# Altium schematic sheet DDS.SchDoc
size 594 x 420 mm; Address1: Address1; Address2: Address2; Address3: Address3; Address4: Address4; SheetNumber: 1; Scale: 1:1; Разраб.: Иванов; Обозначение документа: АБВГ.123456.001 Э3; Пров.: Петров; Утв.: Сидоров; Наименование организации: ОАО "Концерн "МПО-Гидроприбор"; Перв. применение: АБВГ.123456.000; Наименование изделия 1: Плата; Наименование изделия 2: Схема электрическая; Наименование изделия 3: принципиальная; Нач. отд.: Нач. отд.; Фамилия нач. отд.: Сидоров
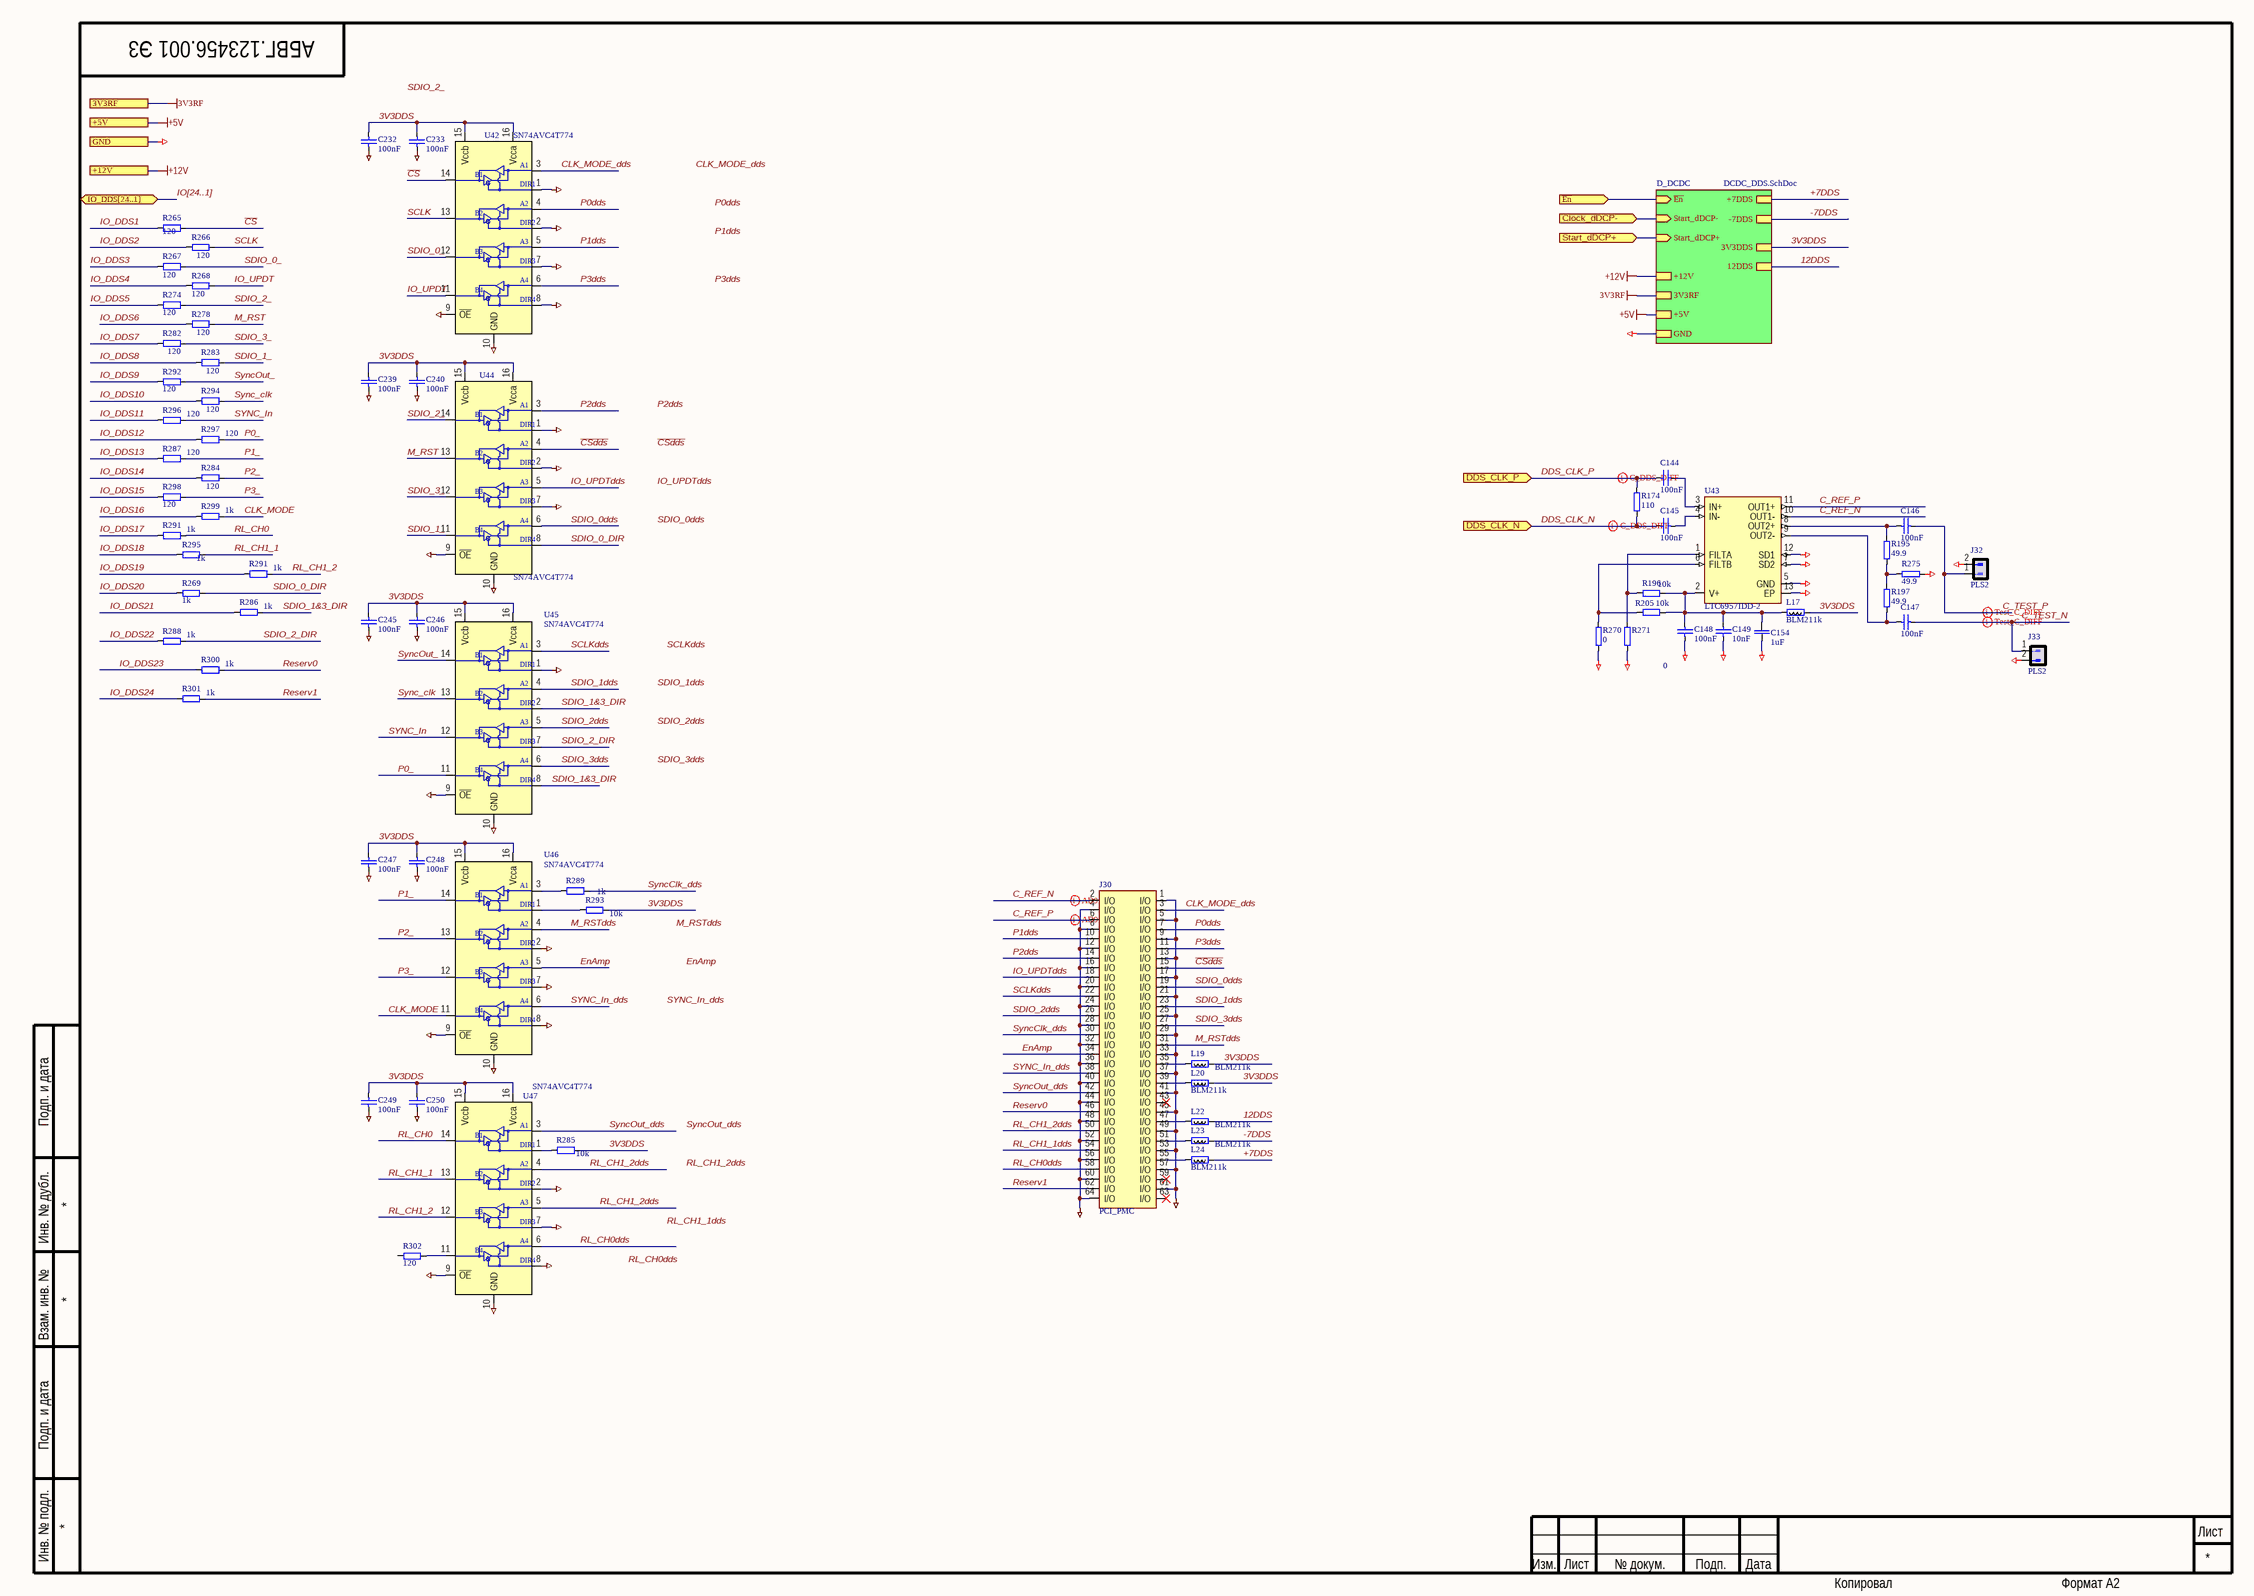
[diagram p0: DDS.SchDoc]

## Parts
(Parts that share a designator on the sheet are numbered #1, #2 ... from top to bottom, then left to right.)
C144  100nF  [CAPC1608X87N]
C145  100nF  [CAPC1608X87N]
C146  100nF  [CAPC1608X87N]
C147  100nF  [CAPC1608X87N]
C148  100nF  [CAPC1608X87N]
C149  10nF  [CAPC1608X87N]
C154  1uF  [0508]
C232  100nF  [SMD0805CAP]
C233  100nF  [SMD0805CAP]
C239  100nF  [SMD0805CAP]
C240  100nF  [SMD0805CAP]
C245  100nF  [SMD0805CAP]
C246  100nF  [SMD0805CAP]
C247  100nF  [SMD0805CAP]
C248  100nF  [SMD0805CAP]
C249  100nF  [SMD0805CAP]
C250  100nF  [SMD0805CAP]
J30  PCI_PMC  [TYCO_120521-1]
J32  PLS2  [PLS2]
J33  PLS2  [PLS2]
L17  BLM211k  [RESC2012X50N]
L19  BLM211k  [RESC2012X50N]
L20  BLM211k  [RESC2012X50N]
L22  BLM211k  [RESC2012X50N]
L23  BLM211k  [RESC2012X50N]
L24  BLM211k  [RESC2012X50N]
R174  110  [RESC1608X64N]
R195  49.9  [RESC1608X64N]
R196  10k  [RESC1608X64N]
R197  49.9  [RESC1608X64N]
R205  10k  [RESC1608X64N]
R265  120  [SMD0805RES]
R266  120  [SMD0805RES]
R267  120  [SMD0805RES]
R268  120  [SMD0805RES]
R269  1k  [SMD0805RES]
R270  0  [RESC1608X64N]
R271  0  [RESC1608X64N]
R274  120  [SMD0805RES]
R275  49.9  [SMD0805RES]
R278  120  [SMD0805RES]
R282  120  [SMD0805RES]
R283  120  [SMD0805RES]
R284  120  [SMD0805RES]
R285  10k  [SMD0805RES]
R286  1k  [SMD0805RES]
R287  120  [SMD0805RES]
R288  1k  [SMD0805RES]
R289  1k  [SMD0805RES]
R291#1  1k  [SMD0805RES]
R291#2  1k  [SMD0805RES]
R292  120  [SMD0805RES]
R293  10k  [SMD0805RES]
R294  120  [SMD0805RES]
R295  1k  [SMD0805RES]
R296  120  [SMD0805RES]
R297  120  [SMD0805RES]
R298  120  [SMD0805RES]
R299  1k  [SMD0805RES]
R300  1k  [SMD0805RES]
R301  1k  [SMD0805RES]
R302  120  [SMD0805RES]
U42  SN74AVC4T774  [TSSOP-16]
U43  LTC6957IDD-2  [DFN13-045]
U44  SN74AVC4T774  [TSSOP-16]
U45  SN74AVC4T774  [TSSOP-16]
U46  SN74AVC4T774  [TSSOP-16]
U47  SN74AVC4T774  [TSSOP-16]

## Sub-sheets
D_DCDC = DCDC_DDS.SchDoc: +7DDS, -7DDS, 3V3DDS, ~{En} (in), Start_dDCP- (in), Start_dDCP+ (in), +5V, GND, 3V3RF, +12V, 12DDS

## Ports
3V3RF, +5V, +12V, Clock_dDCP- (in), DDS_CLK_N (in), DDS_CLK_P (in), GND, IO_DDS[24..1] (bidir), Start_dDCP+ (in), ~{En} (in)

## Nets
3V3RF: port 3V3RF, sheet D_DCDC/3V3RF
+5V: port +5V, sheet D_DCDC/+5V
+12V: port +12V, sheet D_DCDC/+12V
GND: C148.1 C149.1 C154.2 C232.1 C233.1 C239.1 C240.1 C245.1 C246.1 C247.1 C248.1 C249.1 C250.1 J30.1(I/O) J30.4(I/O) J30.5(I/O) J30.8(I/O) J30.9(I/O) J30.12(I/O) J30.13(I/O) J30.16(I/O) J30.17(I/O) J30.20(I/O) J30.21(I/O) J30.24(I/O) J30.25(I/O) J30.28(I/O) J30.29(I/O) J30.32(I/O) J30.33(I/O) J30.36(I/O) J30.37(I/O) J30.40(I/O) J30.41(I/O) J30.44(I/O) J30.45(I/O) J30.48(I/O) J30.49(I/O) J30.52(I/O) J30.53(I/O) J30.56(I/O) J30.57(I/O) J30.60(I/O) J30.61(I/O) J30.64(I/O) J32.2 J33.2 R270.1 R271.1 R275.1 U42.1(DIR1) U42.2(DIR2) U42.7(DIR3) U42.8(DIR4) U42.9(~{OE}) U42.10(GND) U43.5(GND) U43.7(SD2) U43.12(SD1) U43.13(EP) U44.1(DIR1) U44.2(DIR2) U44.7(DIR3) U44.9(~{OE}) U44.10(GND) U45.1(DIR1) U45.9(~{OE}) U45.10(GND) U46.2(DIR2) U46.7(DIR3) U46.8(DIR4) U46.9(~{OE}) U46.10(GND) U47.2(DIR2) U47.7(DIR3) U47.8(DIR4) U47.9(~{OE}) U47.10(GND) ; port GND, sheet D_DCDC/GND
3V3DDS: C232.2 C233.2 C239.2 C240.2 C245.2 C246.2 C247.2 C248.2 C249.2 C250.2 L17.2 L19.2 L20.2 R285.1 R293.1 U42.15(Vccb) U42.16(Vcca) U44.15(Vccb) U44.16(Vcca) U45.15(Vccb) U45.16(Vcca) U46.15(Vccb) U46.16(Vcca) U47.15(Vccb) U47.16(Vcca) ; sheet D_DCDC/3V3DDS
12DDS: L22.2 ; sheet D_DCDC/12DDS
+7DDS: L24.2 ; sheet D_DCDC/+7DDS
-7DDS: L23.2 ; sheet D_DCDC/-7DDS
~{CS}: R265.1 U42.14(B1)
~{CSdds}: J30.15(I/O) U44.4(A2)
~{En}: port ~{En}, sheet D_DCDC/~{En}
C_REF_N: J30.2(I/O) U43.10(OUT1-)
C_REF_P: J30.6(I/O) U43.11(OUT1+)
C_TEST_N: C147.2 J33.1
C_TEST_P: C146.2 J32.1
CLK_MODE: R299.1 U46.11(B4)
CLK_MODE_dds: J30.3(I/O) U42.3(A1)
Clock_dDCP-: port Clock_dDCP-, sheet D_DCDC/Start_dDCP-
DDS_CLK_N: C145.1 R174.1 ; port DDS_CLK_N
DDS_CLK_P: C144.1 R174.2 ; port DDS_CLK_P
EnAmp: J30.34(I/O) U46.5(A3)
IO_DDS1: R265.2
IO_DDS2: R266.2
IO_DDS3: R267.2
IO_DDS4: R268.2
IO_DDS5: R274.2
IO_DDS6: R278.2
IO_DDS7: R282.2
IO_DDS8: R283.2
IO_DDS9: R292.2
IO_DDS10: R294.2
IO_DDS11: R296.2
IO_DDS12: R297.2
IO_DDS13: R287.2
IO_DDS14: R284.2
IO_DDS15: R298.2
IO_DDS16: R299.2
IO_DDS17: R291#1.2
IO_DDS18: R295.2
IO_DDS19: R291#2.2
IO_DDS20: R269.1
IO_DDS21: R286.2
IO_DDS22: R288.2
IO_DDS23: R300.2
IO_DDS24: R301.2
IO_UPDT: R268.1 U42.11(B4)
IO_UPDTdds: J30.18(I/O) U44.5(A3)
M_RST: R278.1 U44.13(B2)
M_RSTdds: J30.31(I/O) U46.4(A2)
P0_: R297.1 U45.11(B4)
P0dds: J30.7(I/O) U42.4(A2)
P1_: R287.1 U46.14(B1)
P1dds: J30.10(I/O) U42.5(A3)
P2_: R284.1 U46.13(B2)
P2dds: J30.14(I/O) U44.3(A1)
P3_: R298.1 U46.12(B3)
P3dds: J30.11(I/O) U42.6(A4)
Reserv0: J30.46(I/O) R300.1
Reserv1: J30.62(I/O) R301.1
RL_CH0: R291#1.1 U47.14(B1)
RL_CH0dds: J30.58(I/O) U47.6(A4)
RL_CH1_1: R295.1 U47.13(B2)
RL_CH1_1dds: J30.54(I/O)
RL_CH1_2: R291#2.1 U47.12(B3)
RL_CH1_2dds: J30.50(I/O) U47.4(A2) U47.5(A3)
SCLK: R266.1 U42.13(B2)
SCLKdds: J30.22(I/O) U45.3(A1)
SDIO_0_: R267.1 U42.12(B3)
SDIO_0_DIR: R269.2 U44.8(DIR4)
SDIO_0dds: J30.19(I/O) U44.6(A4)
SDIO_1&3_DIR: R286.1 U45.2(DIR2) U45.8(DIR4)
SDIO_1_: R283.1 U44.11(B4)
SDIO_1dds: J30.23(I/O) U45.4(A2)
SDIO_2_: R274.1 U44.14(B1)
SDIO_2_DIR: R288.1 U45.7(DIR3)
SDIO_2dds: J30.26(I/O) U45.5(A3)
SDIO_3_: R282.1 U44.12(B3)
SDIO_3dds: J30.27(I/O) U45.6(A4)
Start_dDCP+: port Start_dDCP+, sheet D_DCDC/Start_dDCP+
Sync_clk: R294.1 U45.13(B2)
SYNC_In: R296.1 U45.12(B3)
SYNC_In_dds: J30.38(I/O) U46.6(A4)
SyncClk_dds: J30.30(I/O) R289.1
SyncOut_: R292.1 U45.14(B1)
SyncOut_dds: J30.42(I/O) U47.3(A1)
NetC144_2: C144.2 U43.3(IN+)
NetC145_2: C145.2 U43.4(IN-)
NetC146_1: C146.1 R195.2 U43.8(OUT2+)
NetC147_1: C147.1 R197.1 U43.9(OUT2-)
NetC148_2: C148.2 C149.2 C154.1 L17.1 R196.2 R205.2 U43.2(V+)
NetJ30_35: J30.35(I/O) L19.1
NetJ30_39: J30.39(I/O) L20.1
NetJ30_47: J30.47(I/O) L22.1
NetJ30_51: J30.51(I/O) L23.1
NetJ30_55: J30.55(I/O) L24.1
NetR195_1: R195.1 R197.2 R275.2
NetR196_1: R196.1 R271.2 U43.1(FILTA)
NetR205_1: R205.1 R270.2 U43.6(FILTB)
NetR285_2: R285.2 U47.1(DIR1)
NetR289_2: R289.2 U46.3(A1)
NetR293_2: R293.2 U46.1(DIR1)
NetR302_1: R302.1 U47.11(B4)

Not connected (* = marked no-connect by the designer): J30 43(I/O)* 59(I/O)* 63(I/O)*; R302 2

## Buses and harness runs
bus IO[24..1] = port IO_DDS[24..1]

## Layout directives
differential pair: C_REF_N, C_REF_P, C_TEST_N, C_TEST_P
differential pair; rule Differential Pairs Routing [Pref Gap = 0.175mm    Min Gap  = 0.075mm    Max Gap  = 0.5mmPref Width = 0.25mm    Min Width  = 0.075mm    Max Width  = 0.5mm]: DDS_CLK_N, DDS_CLK_P

## Notes on the sheet
- Labels drawn without touching a wire or pin: CLK_MODE_dds, EnAmp, IO_UPDTdds, M_RSTdds, P0dds, P1dds, P2dds, P3dds, RL_CH0dds, RL_CH1_1dds, RL_CH1_2dds, SCLKdds, SDIO_0dds, SDIO_1dds, SDIO_2_, SDIO_2dds, SDIO_3dds, SYNC_In_dds, SyncOut_dds, ~{CSdds}
- Подп. и дата
- Инв. № дубл.
- Взам. инв. №
- Инв. № подл.
- Изм.
- Лист
- № докум.
- Подп.
- Дата
- Копировал
- Формат А2

## Library data of the parts
C144-C149 = C0603: Чип конденсатор 0603; Voltage: 50V; Vendor: Vishay; DielectricType: X5R; SMD Solders: 2; Solder Option: RM; Tolerance: 20%; Pkg: SMD0603; Device: Cap603; Price: 2
  C144-C148: Value: 100nF
  C149: Value: 10nF
C154 = CAP_LLL219R71A105: 1uF; 10V; 0805R; X7R; Low ESL; Reverse geometry; Vendor: muRata; SolderOption: 2; THD Solders: 0; PartField: LLL219R71A105; Pkg: 0508; Value: 1uF; SMD Solders: 2; ClassName: Soldered_BINP
C232 C233 C239 C240 C245-C250 = C0805: Чип конденсатор 0805; Voltage: 25V; Vendor: Vishay; DielectricType: X5R; SMD Solders: 2; Solder Option: RM; Tolerance: 20%; Pkg: SMD0805; Device: Cap0805; Value: 100nF; Price: 2
J30 = PCI_PMC_M: PCI Mezzanine Connector; IEEE 1386 MainBoard; Manufactuer: TE Connectivity; PartField: 120527-1; SolderOption: 2; Pkg: PMC Male (IEEE 1386); Value: PCI_PMC; Vendor: TE Connectivity
J32 J33 = PLS2: Vendor: Confly; SMD Solders: 0; Solder Option: RM; THD Solders: 2; Price: 1; Device: PLS2
L17 L19 L20 L22-L24 = BLM21: SMD Ferrite bead 0805; Vendor: Vishay; Value: 1k; Pkg: SMD0805; SMD Solders: 2; Solder Option: RM; Price: 10; Device: BLM21
R174 R195-R197 R205 R270 R271 = R0603: Чип резистор 0603; Vendor: Vishay; SMD Solders: 2; Solder Option: RM; TC: 100ppm/C; Tolerance: 1%; Pkg: SMD0603; Pwr: 60mW; Device: Res603; Price: 2
  R174: Value: 110
  R195 R197: Value: 49.9
  R196 R205: Value: 10k
  R270 R271: Value: 0
R265-R268 R274 R278 R282-R289 R291#1 R291#2 R292-R302 = R0805: Чип резистор 0805; Vendor: Vishay; SMD Solders: 2; Solder Option: i; TC: 100ppm/C; Tolerance: 1%; Pkg: SMD0805; Pwr: 125mW; Device: Res0805; Price: 2
  R265-R268 R274 R278 R282-R284 R287 R292 R294 R296-R298 R302: Value: 120
  R285 R293: Value: 10k
  R286 R288 R289 R291#1 R291#2 R295 R299-R301: Value: 1k
R269 R275 = R0805: Чип резистор 0805; Vendor: Vishay; SMD Solders: 2; Solder Option: RM; TC: 100ppm/C; Tolerance: 1%; Pkg: SMD0805; Pwr: 125mW; Device: Res0805; Price: 2
  R269: Value: 1k
  R275: Value: 49.9
U42 U44-U47 = SN74AVC4T774: Двунаправленный буфер; Pkg: TSSOP16; SMD Solders: 16; Solder Option: RM; THD Solders: 0; Vendor: Texas Instruments; Voltage: 1V1.. 3.6V  I/Os are 4.6-V Tolerant; Name to order: SN74AVC4T774PW; Device: SN74AVC4T774; Price: 300
U43 = LTC6957-2: Bufer CMOS in to 2xLVDS out; Vendor: Analog Devices; Pkg: DFN045-13; SMD Solders: 13; Solder Option: outSrc; THD Solders: 0; Current: 72; Voltage: 2.15.. 3.45; Price: 4200; Device: LTC6957IDD-2; Name to order: LTC6957IDD-2